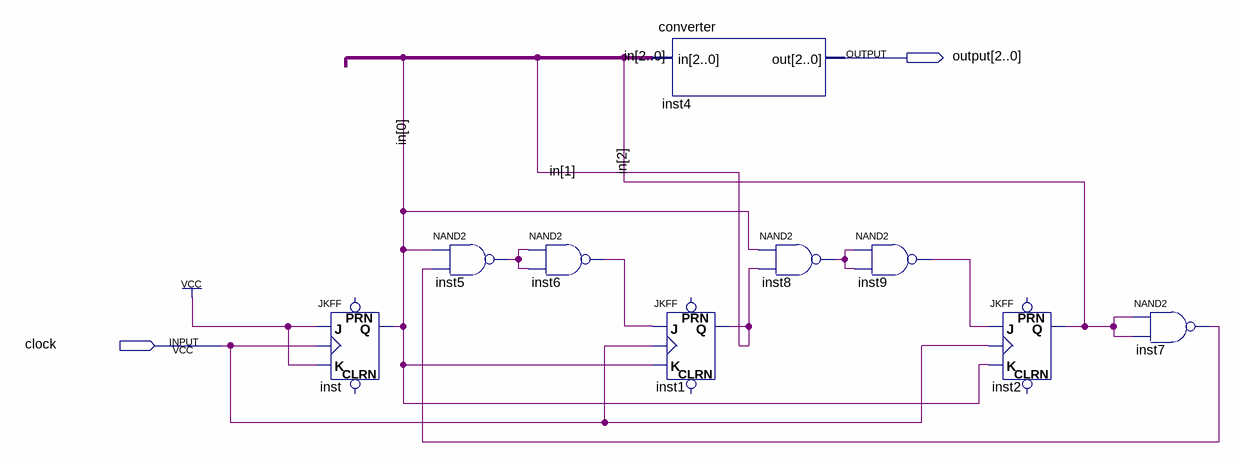
[diagram p0: schematic sheet]
// Quartus schematic modulo.bdf as structural Verilog: 9 symbols, 2 pins
module modulo (
  input  clock,
  output [2:0] \output 
);

  wire inst5_out, inst6_out, inst7_out, inst8_out, inst9_out;
  wire [2:0] in;

  JKFF inst (.K(1'b1), .J(1'b1), .CLK(clock), .Q(in[0]));  // open: PRN, CLRN
  nand inst5 (inst5_out, in[0], inst7_out);
  nand inst6 (inst6_out, inst5_out, inst5_out);
  converter inst4 (.in(in), .out(\output ));
  JKFF inst1 (.K(in[0]), .J(inst6_out), .CLK(clock), .Q(in[1]));  // open: PRN, CLRN
  nand inst8 (inst8_out, in[0], in[1]);
  nand inst9 (inst9_out, inst8_out, inst8_out);
  JKFF inst2 (.K(in[0]), .J(inst9_out), .CLK(clock), .Q(in[2]));  // open: PRN, CLRN
  nand inst7 (inst7_out, in[2], in[2]);
endmodule
